# Altium schematic sheet MFR-25FBF52-470R1_MFR-25FBF52-470R.schdoc
size 127 x 99 mm
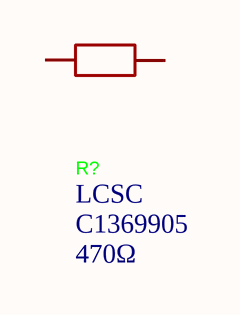
[diagram p0: MFR-25FBF52-470R1_MFR-25FBF52-470R.schdoc]

## Parts
R?  Supplier Part: C1369905  Supplier: LCSC  [RES-TH_BD2.4-L6.3-P10.30-D0.6]  (hidden comment: 470Ω)

## Nets

Not connected (* = marked no-connect by the designer): R? 1 2

## Library data of the parts
R? = MFR-25FBF52-470R: Manufacturer: YAGEO(国巨); Add into BOM: yes; Tolerance: ±1%; Power(Watts): 250mW; Temperature Coefficient: ±100ppm/℃; Symbol: MFR-25FBF52-470R; Device: MFR-25FBF52-470R; Value: 470Ω; LCSC Part Name: 金属膜电阻 470Ω ±1% 250mW; Manufacturer Part: MFR-25FBF52-470R; Supplier Footprint: 插件,D2.4xL6.3mm; JLCPCB Part Class: Extended Part; Datasheet: https://item.szlcsc.com/datasheet/MFR-25FBF52-470R/1460194.html; Convert to PCB: yes; Type: Metal Film Resistor; Operating Temperature: -55℃~+155℃